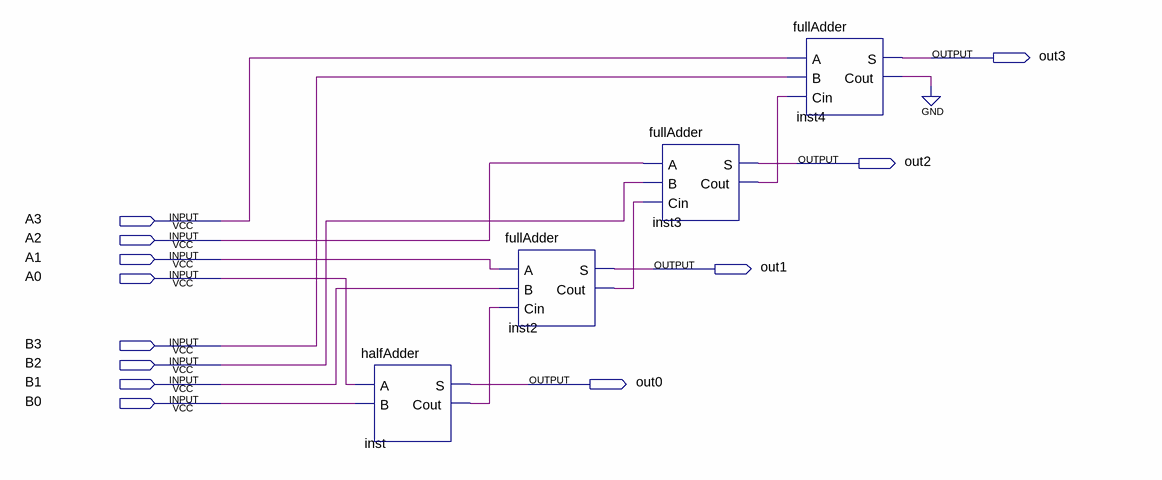
[diagram p0: schematic sheet]
// Quartus schematic adder4Bits.bdf as structural Verilog: 4 symbols, 12 pins
module adder4Bits (
  input  A3,
  input  A2,
  input  A1,
  input  A0,
  input  B3,
  input  B2,
  input  B1,
  input  B0,
  output out3,
  output out2,
  output out1,
  output out0
);

  wire inst2_cout, inst3_cout, inst4_cout, inst_cout;

  halfAdder inst (.A(A0), .B(B0), .S(out0), .Cout(inst_cout));
  fullAdder inst2 (.A(A1), .B(B1), .Cin(inst_cout), .S(out1), .Cout(inst2_cout));
  fullAdder inst3 (.A(A2), .B(B2), .Cin(inst2_cout), .S(out2), .Cout(inst3_cout));
  fullAdder inst4 (.A(A3), .B(B3), .Cin(inst3_cout), .S(out3), .Cout(inst4_cout));
  // also tied to GND on the sheet: inst4_cout
endmodule
